# EAGLE schematic untitled (EAGLE 9.3.0)
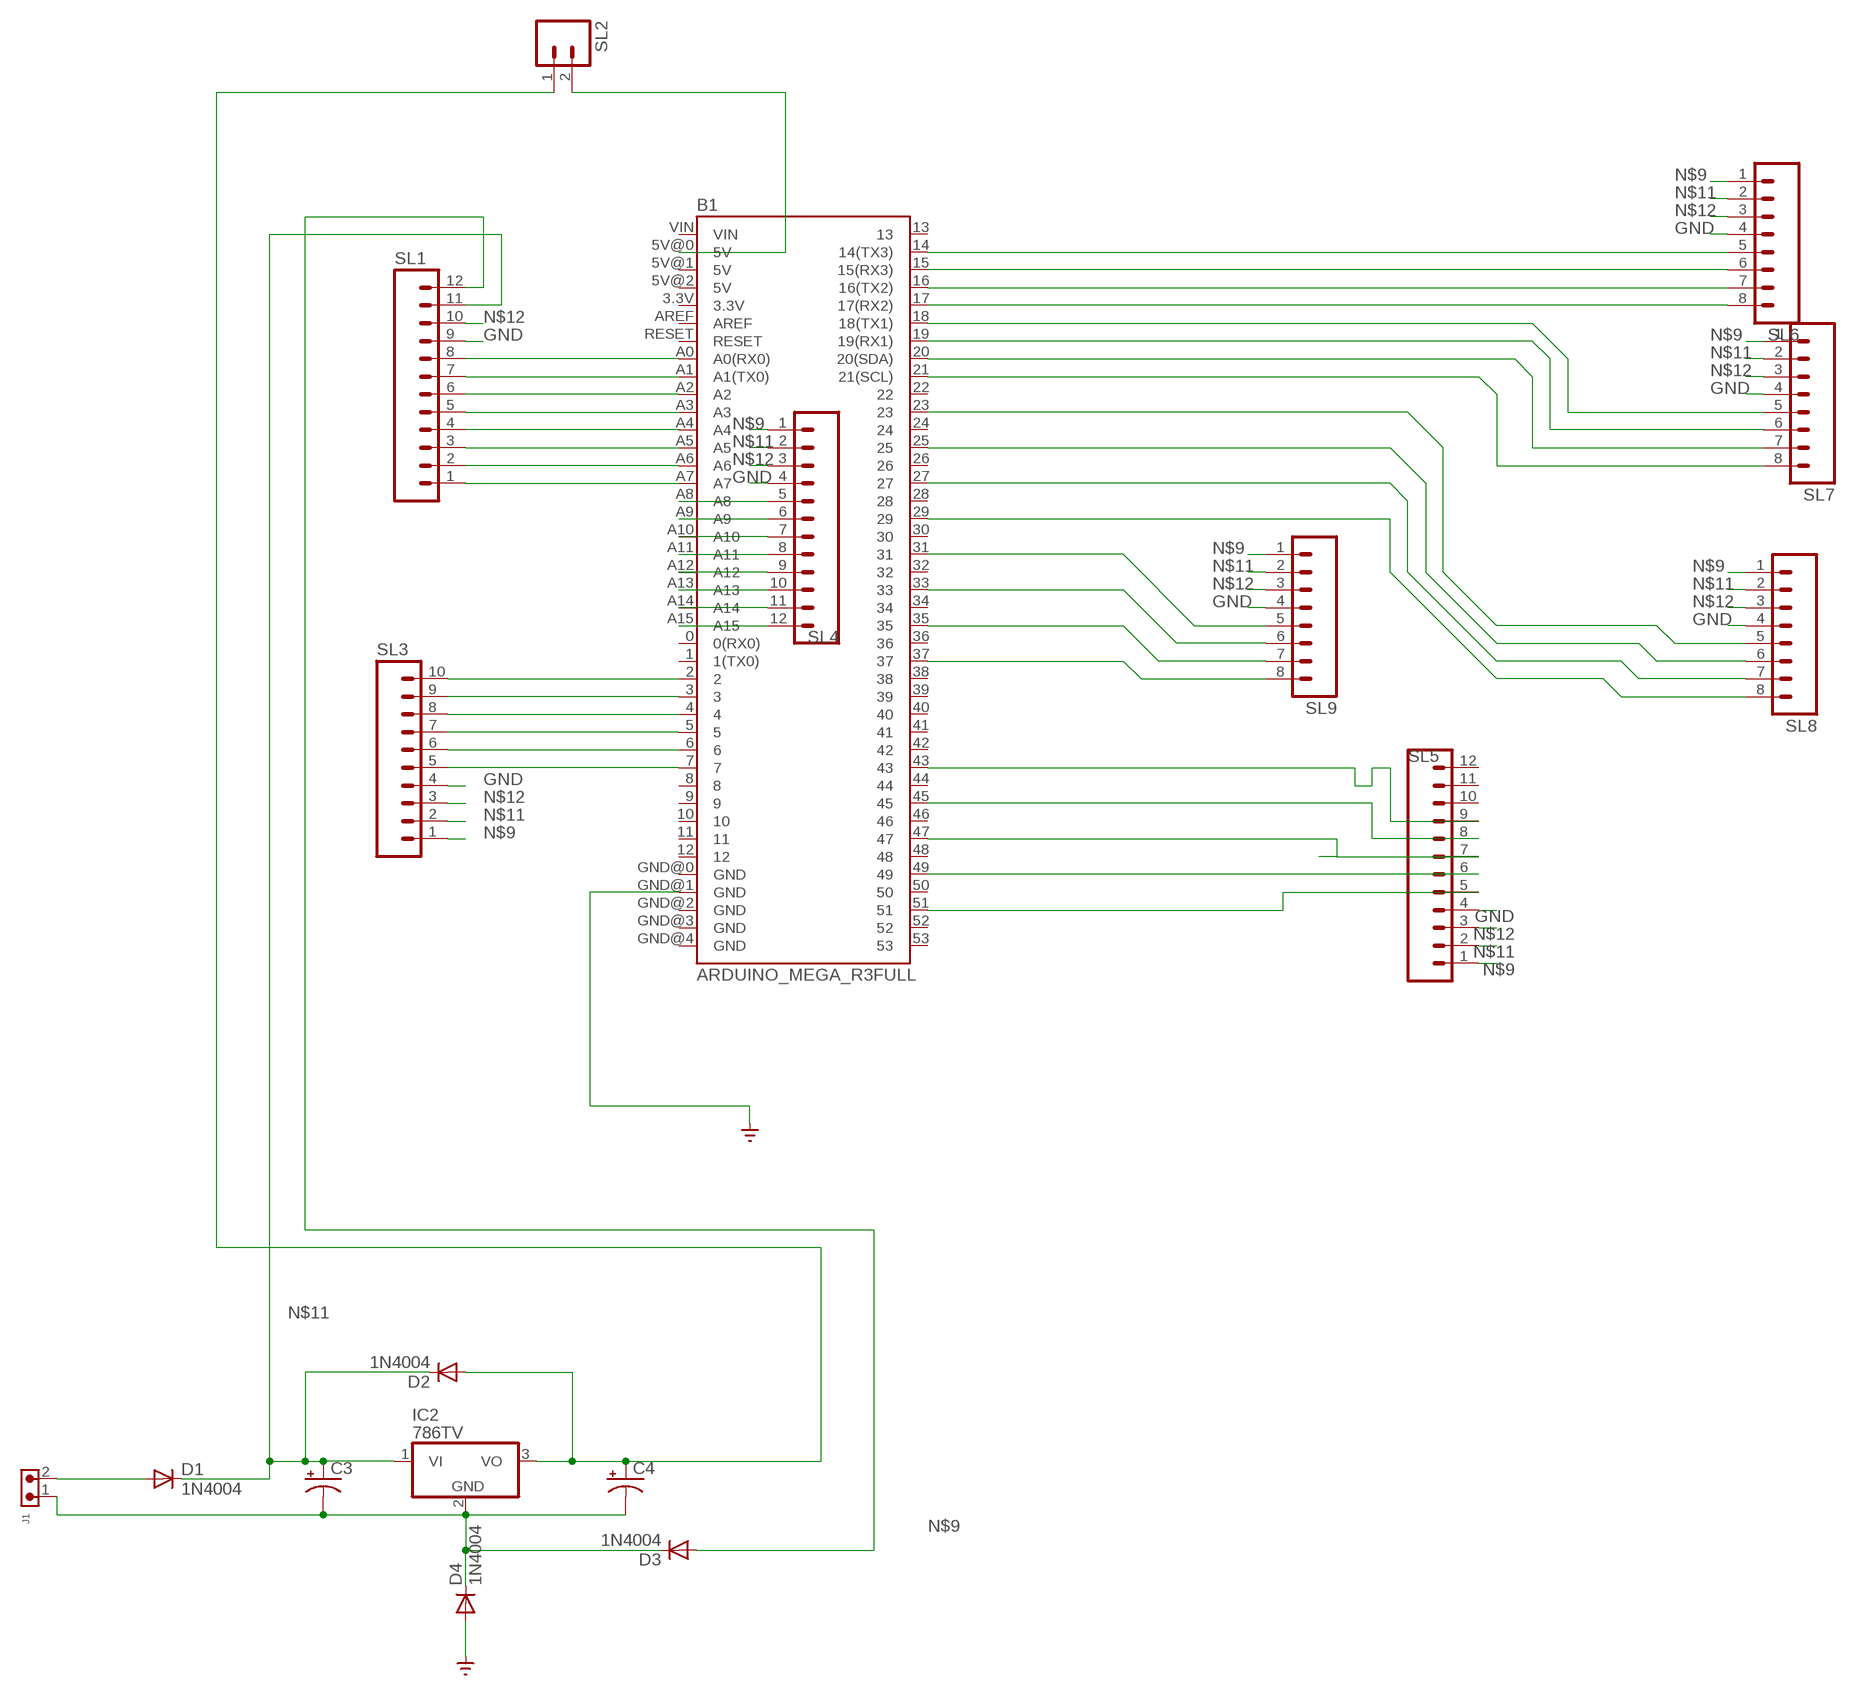
[diagram p0: schematic, sheet 1]

## Parts
B1  ARDUINO_MEGA_R3FULL  [ARDUINO_MEGA]
C3  CAPACITOR-PE5-10.5  [E5-10,5]
C4  CAPACITOR-PE5-6  [E5-6]
D1  1N4004  [DO41-10]
D2  1N4004  [DO41-10]
D3  1N4004  [DO41-10]
D4  1N4004  [DO41-10]
IC2  786TV  [TO220V]
J1  691305530002  [691305530002]
SL1  M12  [12P]
SL2  M02  [02P]
SL3  M10  [10P]
SL4  M12  [12P]
SL5  M12  [12P]
SL6  M08  [08P]
SL7  M08  [08P]
SL8  M08  [08P]
SL9  M08  [08P]

## Nets
GND: B1.GND@1(GND) D4.A SL1.9 SL3.4 SL4.4 SL5.4 SL6.4 SL7.4 SL8.4 SL9.4 ; supply symbol labelled SUPPLY_BRASTAN_GND_
N$1: B1.A7 SL1.1
N$2: B1.A6 SL1.2
N$3: B1.A5 SL1.3
N$4: B1.A4 SL1.4
N$5: B1.A3 SL1.5
N$6: B1.A2 SL1.6
N$7: B1.A1(A1(TX0)) SL1.7
N$8: B1.A0(A0(RX0)) SL1.8
N$9: D3.A SL1.12 SL3.1 SL4.1 SL5.1 SL6.1 SL7.1 SL8.1 SL9.1
N$10: D1.A J1.2
N$11: C3.+ D1.C D2.C IC2.1(VI) SL1.11 SL3.2 SL4.2 SL5.2 SL6.2 SL7.2 SL8.2 SL9.2
N$12: C4.+ D2.A IC2.3(VO) SL1.10 SL2.1 SL3.3 SL4.3 SL5.3 SL6.3 SL7.3 SL8.3 SL9.3
N$13: B1.2 SL3.10
N$14: C3.- C4.- D3.C D4.C IC2.2(GND) J1.1
N$15: B1.3 SL3.9
N$16: B1.5V@0(5V) SL2.2
N$17: B1.4 SL3.8
N$18: B1.5 SL3.7
N$19: B1.6 SL3.6
N$20: B1.7 SL3.5
N$21: B1.A8 SL4.5
N$22: B1.A9 SL4.6
N$23: B1.A10 SL4.7
N$24: B1.A11 SL4.8
N$25: B1.A12 SL4.9
N$26: B1.A13 SL4.10
N$27: B1.A14 SL4.11
N$28: B1.A15 SL4.12
N$29: B1.18(18(TX1)) SL7.5
N$30: B1.14(14(TX3)) SL6.5
N$31: B1.51 SL5.5
N$32: B1.49 SL5.6
N$33: B1.47 SL5.7
N$34: B1.45 SL5.8
N$35: B1.43 SL5.9
N$39: B1.21(21(SCL)) SL7.8
N$40: B1.15(15(RX3)) SL6.6
N$42: B1.17(17(RX2)) SL6.8
N$43: B1.20(20(SDA)) SL7.7
N$46: B1.19(19(RX1)) SL7.6
N$49: B1.31 SL9.5
N$50: B1.33 SL9.6
N$51: B1.35 SL9.7
N$52: B1.37 SL9.8
N$53: B1.23 SL8.5
N$54: B1.25 SL8.6
N$55: B1.29 SL8.8
N$56: B1.27 SL8.7
N$57: B1.16(16(TX2)) SL6.7
Unconnected: B1.0(0(RX0)) B1.1(1(TX0)) B1.3.3V B1.5V@1(5V) B1.5V@2(5V) B1.8 B1.9 B1.10 B1.11 B1.12 B1.13 B1.22 B1.24 B1.26 B1.28 B1.30 B1.32 B1.34 B1.36 B1.38 B1.39 B1.40 B1.41 B1.42 B1.44 B1.46 B1.48 B1.50 B1.52 B1.53 B1.AREF B1.GND@0(GND) B1.GND@2(GND) B1.GND@3(GND) B1.GND@4(GND) B1.RESET B1.VIN SL5.10 SL5.11 SL5.12

## Library data of the parts
B1 = SparkFun-Boards:ARDUINO_MEGA_R3: Arduino Mega R3 ATmega2560 R3 compatible footprint. SparkFun Products: Arduino Mega 2560 R3 <https://www.sparkfun.com/products/11061>
C3 C4 = BeagleBone_Blue_R3:CAPACITOR-P: POLARIZED CAPACITOR, American symbol
D1-D4 = adafruit:1N4004: DIODE General purpose 1N400x type rectifier (With bigger pads) http://www.ladyada.net/library/pcb/eaglelibrary.html
IC2 = linear:78*: Positive VOLTAGE REGULATOR Source: http://cache.national.com/ds/LM/LM78L05.pdf http://www.fairchildsemi.com/ds/LM/LM7805.pdf
J1 = Wurth_Connectors_WR-TBL Pluggable Connector:691305530002: WR-TBL Serie 3055 - 5,08 mm - PCB Header Vertical Entry with Plastic Latches KIND PROPERTIES Pitch 5.08 mm MATERIAL PROPERTIES Insulator Material PA66 Insulator Flammability Rating UL94 V-0 Insulator Color Green Terminal Material Copper Alloy Terminal Plating Tin-plated surface GENERAL INFORMATION Operating Temperature -40 up to +105 °C ELECTRICAL PROPERTIES IR UL 16 A Working Voltage [UL] 300 V (AC) Withstanding Voltage [UL] 2500 V (AC) Contact Resistance [UL] 20 mΩ CERTIFICATION UL Approval E315414 <https://www.we-online.com/catalog/media/o135349v209%20Family_WR-TBL3_6913055300xx.jpg> Details see: https://www.we-online.com/catalog/en/TBL_5_08_3055_6913055300XX/ Updated by Ella Wu 2019-12-30 2019(C) Wurth Elektronik; DATASHEET-URL: https://www.we-online.com/catalog/datasheet/691305530002.pdf; IR-UL: 16A; MOUNT: THT; PART-NUMBER: 691305530002; PINS: 2; PITCH: 5.08mm; TYPE: Vertical; WORKING-VOLTAGE-UL: 300V (AC)
SL1 SL4 SL5 = con-amp-quick:M12: AMP QUICK CONNECTOR; OC_FARNELL: unknown; OC_NEWARK: unknown
SL2 = con-amp-quick:M02: AMP QUICK CONNECTOR; OC_FARNELL: unknown; OC_NEWARK: unknown
SL3 = con-amp-quick:M10: AMP QUICK CONNECTOR; OC_FARNELL: unknown; OC_NEWARK: unknown
SL6-SL9 = con-amp-quick:M08: AMP QUICK CONNECTOR; OC_FARNELL: unknown; OC_NEWARK: unknown